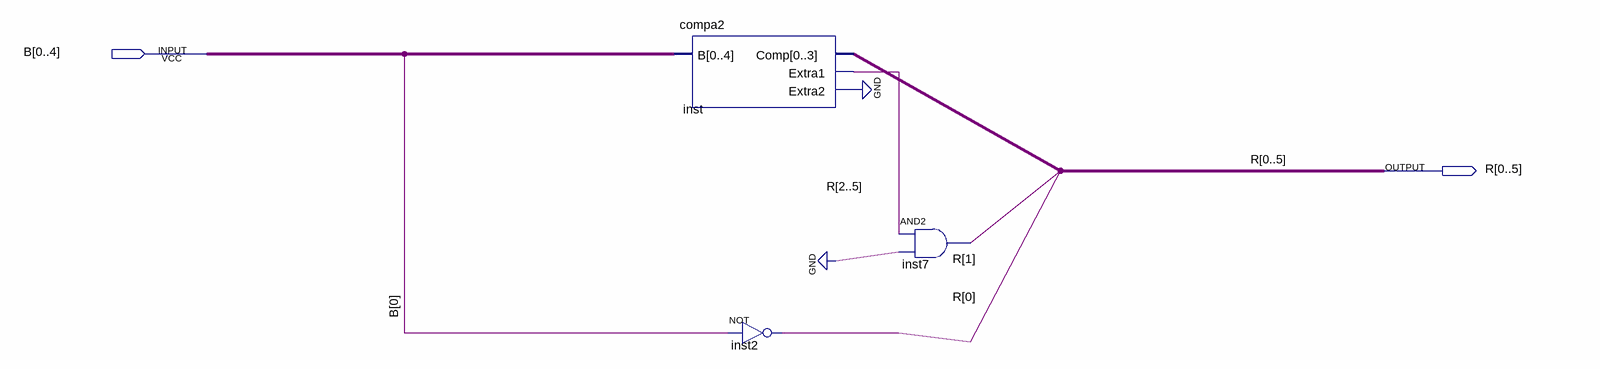
[diagram p0: schematic sheet]
// Quartus schematic Compa2Final.bdf as structural Verilog: 3 symbols, 2 pins
module Compa2Final (
  input  [0:4] B,
  output [0:5] R
);

  wire inst_extra1, inst_extra2;

  compa2 inst (.B(B), .Comp(R[2:5]), .Extra1(inst_extra1), .Extra2(inst_extra2));
  not inst2 (R[0], B[0]);
  and inst7 (R[1], inst_extra1, 1'b0);
  // also tied to GND on the sheet: inst_extra2
endmodule
